# Altium schematic sheet sensors.SchDoc: SENSORS unit
size A2; DocumentNumber: UCNC.02.00.001
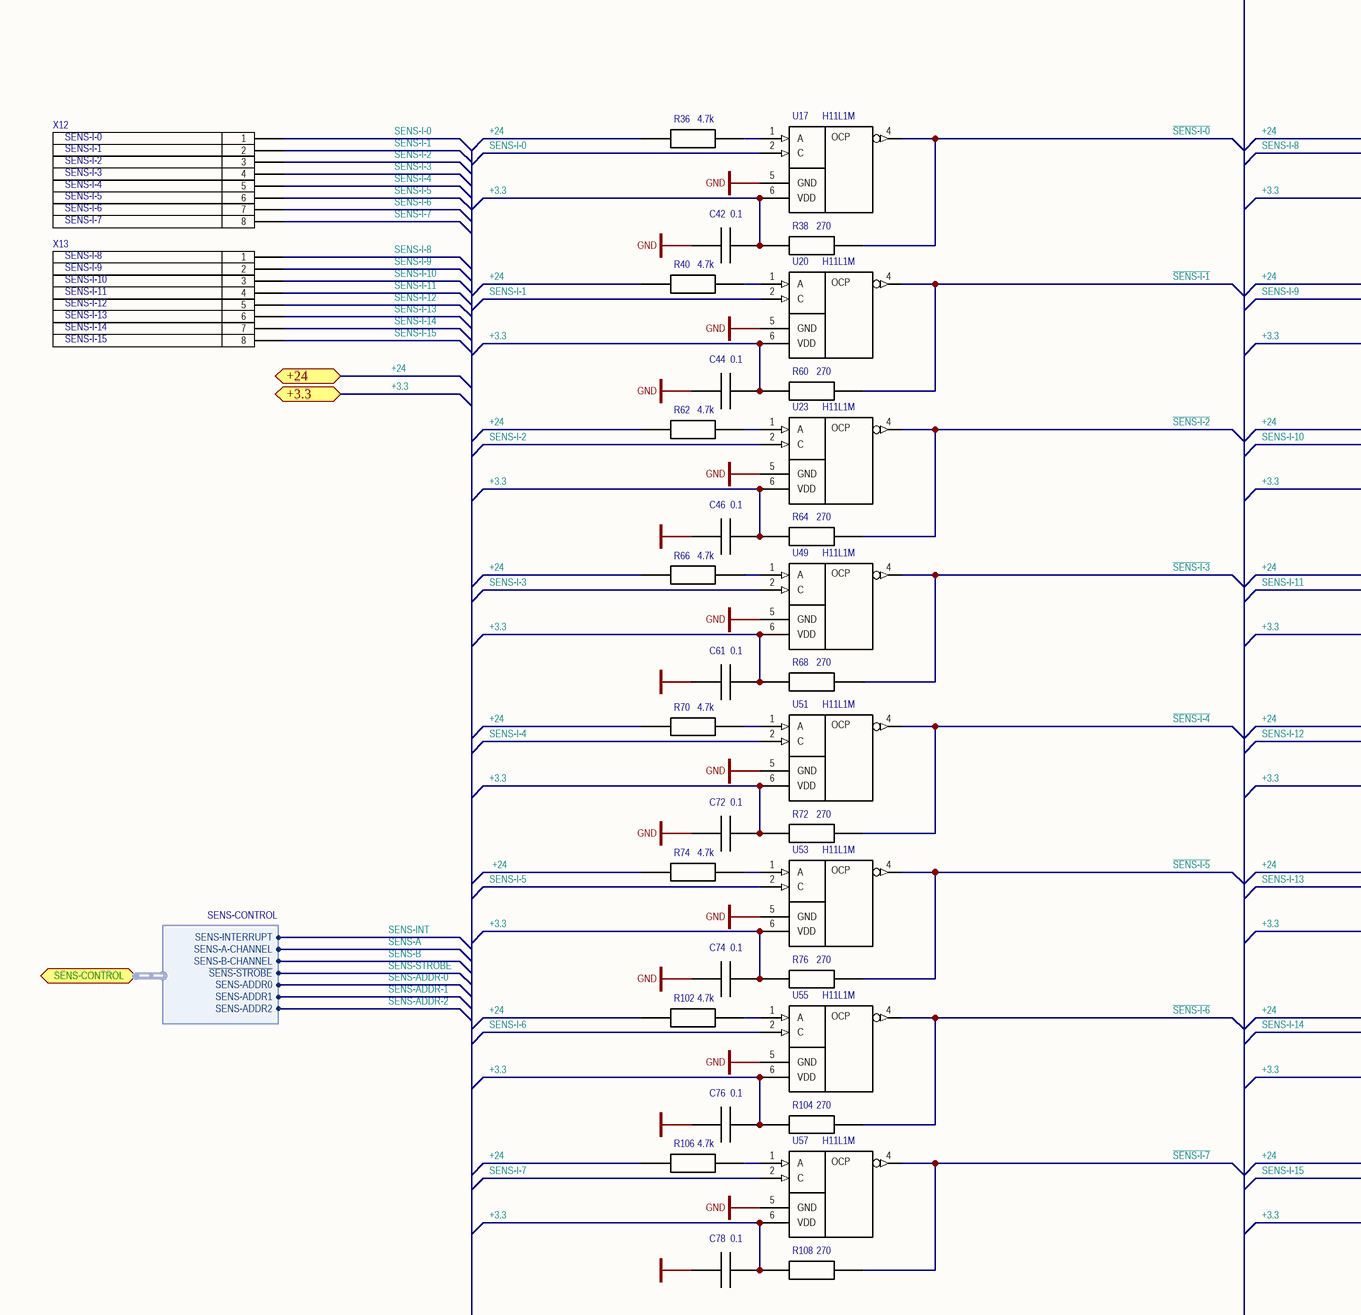
[diagram p0: sensors.SchDoc, top left]
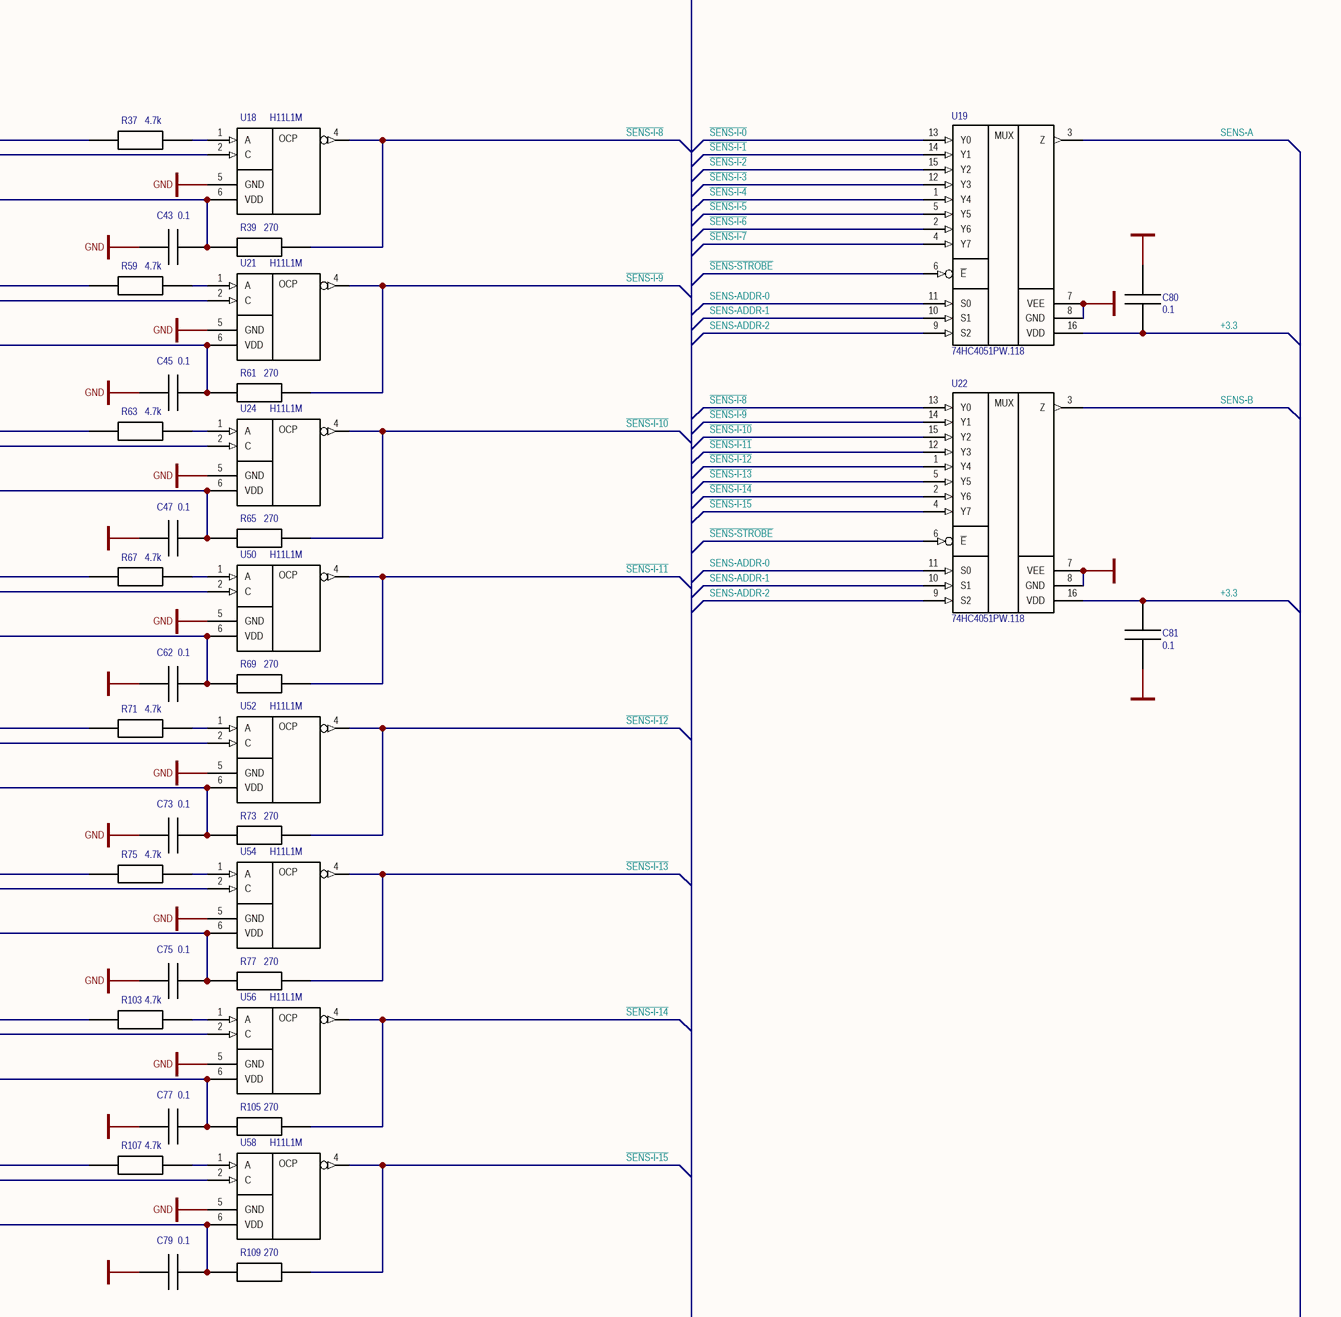
[diagram p1: sensors.SchDoc, top right]
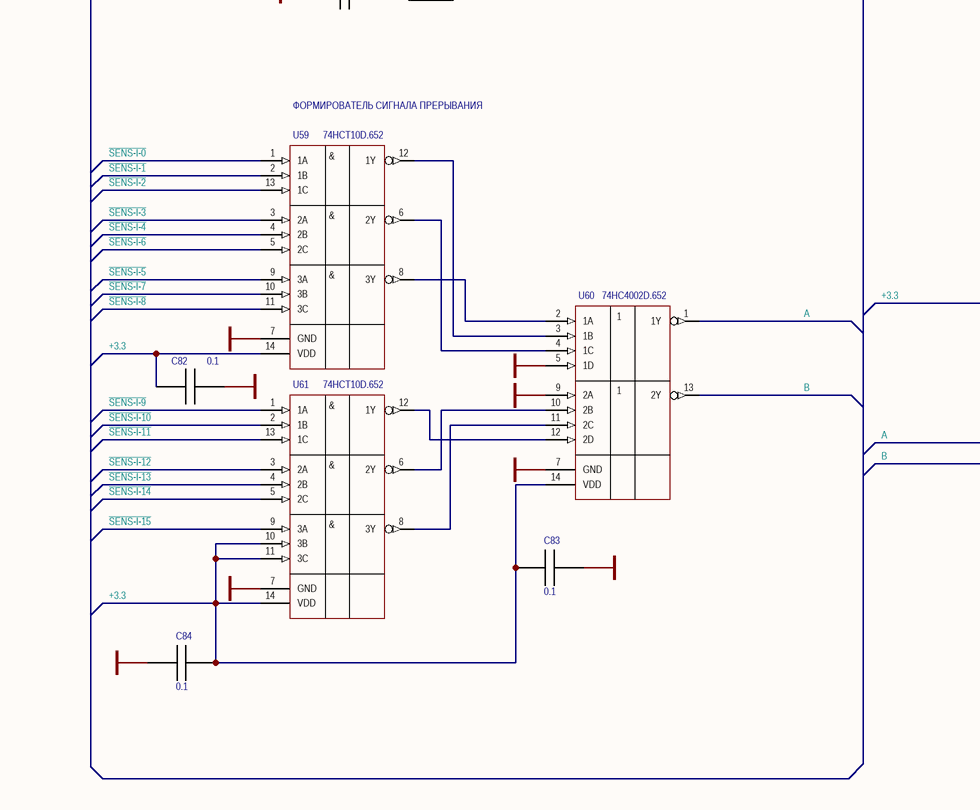
[diagram p2: sensors.SchDoc, bottom left]
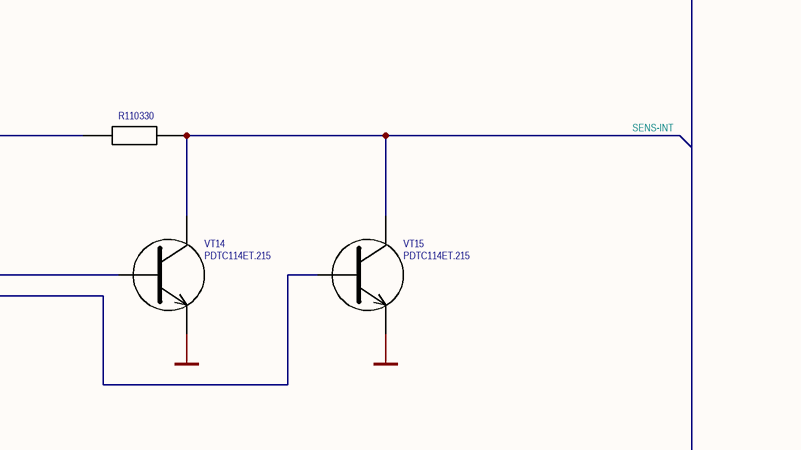
[diagram p3: sensors.SchDoc, bottom right]

## Parts
C42  0.1  [CAPC2012X04N]
C43  0.1  [CAPC2012X04N]
C44  0.1  [CAPC2012X04N]
C45  0.1  [CAPC2012X04N]
C46  0.1  [CAPC2012X04N]
C47  0.1  [CAPC2012X04N]
C61  0.1  [CAPC2012X04N]
C62  0.1  [CAPC2012X04N]
C72  0.1  [CAPC2012X04N]
C73  0.1  [CAPC2012X04N]
C74  0.1  [CAPC2012X04N]
C75  0.1  [CAPC2012X04N]
C76  0.1  [CAPC2012X04N]
C77  0.1  [CAPC2012X04N]
C78  0.1  [CAPC2012X04N]
C79  0.1  [CAPC2012X04N]
C80  0.1  [CAPC2012X04N]
C81  0.1  [CAPC2012X04N]
C82  0.1  [CAPC2012X04N]
C83  0.1  [CAPC2012X04N]
C84  0.1  [CAPC2012X04N]
R36  4.7k  [RESC2012X04N]
R37  4.7k  [RESC2012X04N]
R38  270  [RESC2012X04N]
R39  270  [RESC2012X04N]
R40  4.7k  [RESC2012X04N]
R59  4.7k  [RESC2012X04N]
R60  270  [RESC2012X04N]
R61  270  [RESC2012X04N]
R62  4.7k  [RESC2012X04N]
R63  4.7k  [RESC2012X04N]
R64  270  [RESC2012X04N]
R65  270  [RESC2012X04N]
R66  4.7k  [RESC2012X04N]
R67  4.7k  [RESC2012X04N]
R68  270  [RESC2012X04N]
R69  270  [RESC2012X04N]
R70  4.7k  [RESC2012X04N]
R71  4.7k  [RESC2012X04N]
R72  270  [RESC2012X04N]
R73  270  [RESC2012X04N]
R74  4.7k  [RESC2012X04N]
R75  4.7k  [RESC2012X04N]
R76  270  [RESC2012X04N]
R77  270  [RESC2012X04N]
R102  4.7k  [RESC2012X04N]
R103  4.7k  [RESC2012X04N]
R104  270  [RESC2012X04N]
R105  270  [RESC2012X04N]
R106  4.7k  [RESC2012X04N]
R107  4.7k  [RESC2012X04N]
R108  270  [RESC2012X04N]
R109  270  [RESC2012X04N]
R110  330  [RESC3216X05N]
U17  H11L1M  [DIP6]
U18  H11L1M  [DIP6]
U19  74HC4051PW.118  [TSOP65P640X120-16N]
U20  H11L1M  [DIP6]
U21  H11L1M  [DIP6]
U22  74HC4051PW.118  [TSOP65P640X120-16N]
U23  H11L1M  [DIP6]
U24  H11L1M  [DIP6]
U49  H11L1M  [DIP6]
U50  H11L1M  [DIP6]
U51  H11L1M  [DIP6]
U52  H11L1M  [DIP6]
U53  H11L1M  [DIP6]
U54  H11L1M  [DIP6]
U55  H11L1M  [DIP6]
U56  H11L1M  [DIP6]
U57  H11L1M  [DIP6]
U58  H11L1M  [DIP6]
U59  74HCT10D.652  [SOIC127P600X175-14N]
U60  74HC4002D.652  [SOIC127P600X175-14N]
U61  74HCT10D.652  [SOIC127P600X175-14N]
VT14  PDTC114ET.215  [SOT95P238X102-3N]
VT15  PDTC114ET.215  [SOT95P238X102-3N]
X12  MINI-FIT-8-WAY-M  [MINI-FIT-8-WAY-SM]  (value not drawn)
X13  MINI-FIT-8-WAY-M  [MINI-FIT-8-WAY-SM]  (value not drawn)

## Ports
+3.3, +24, SENS-CONTROL (harness SENS-CONTROL)

## Harnesses
SENS-CONTROL: SENS-INTERRUPT, SENS-A-CHANNEL, SENS-B-CHANNEL, ~{SENS-STROBE}, SENS-ADDR0, SENS-ADDR1, SENS-ADDR2

## Nets
GND: C42.1 C43.1 C44.1 C45.1 C46.1 C47.1 C61.1 C62.1 C72.1 C73.1 C74.1 C75.1 C76.1 C77.1 C78.1 C79.1 C80.2 C81.1 C82.2 C83.2 C84.1 U17.5(GND) U18.5(GND) U19.7(VEE) U19.8(GND) U20.5(GND) U21.5(GND) U22.7(VEE) U22.8(GND) U23.5(GND) U24.5(GND) U49.5(GND) U50.5(GND) U51.5(GND) U52.5(GND) U53.5(GND) U54.5(GND) U55.5(GND) U56.5(GND) U57.5(GND) U58.5(GND) U59.7(GND) U60.5(1D) U60.7(GND) U60.9(2A) U61.7(GND) VT14.2(E) VT15.2(E)
+3.3: C42.2 C43.2 C44.2 C45.2 C46.2 C47.2 C61.2 C62.2 C72.2 C73.2 C74.2 C75.2 C76.2 C77.2 C78.2 C79.2 C80.1 C81.2 C82.1 C83.1 C84.2 R38.1 R39.1 R60.1 R61.1 R64.1 R65.1 R68.1 R69.1 R72.1 R73.1 R76.1 R77.1 R104.1 R105.1 R108.1 R109.1 R110.1 U17.6(VDD) U18.6(VDD) U19.16(VDD) U20.6(VDD) U21.6(VDD) U22.16(VDD) U23.6(VDD) U24.6(VDD) U49.6(VDD) U50.6(VDD) U51.6(VDD) U52.6(VDD) U53.6(VDD) U54.6(VDD) U55.6(VDD) U56.6(VDD) U57.6(VDD) U58.6(VDD) U59.14(VDD) U60.14(VDD) U61.10(3B) U61.11(3C) U61.14(VDD) ; port +3.3
+24: R36.1 R37.1 R40.1 R59.1 R62.1 R63.1 R66.1 R67.1 R70.1 R71.1 R74.1 R75.1 R102.1 R103.1 R106.1 R107.1 ; port +24
A: U60.1(1Y) VT14.1(B)
B: U60.13(2Y) VT15.1(B)
~{SENS-I-0}: R38.2 U17.4(OUT) U19.13(Y0) U59.1(1A)
~{SENS-I-1}: R60.2 U19.14(Y1) U20.4(OUT) U59.2(1B)
~{SENS-I-10}: R65.2 U22.15(Y2) U24.4(OUT) U61.2(1B)
~{SENS-I-11}: R69.2 U22.12(Y3) U50.4(OUT) U61.13(1C)
~{SENS-I-12}: R73.2 U22.1(Y4) U52.4(OUT) U61.3(2A)
~{SENS-I-13}: R77.2 U22.5(Y5) U54.4(OUT) U61.4(2B)
~{SENS-I-14}: R105.2 U22.2(Y6) U56.4(OUT) U61.5(2C)
~{SENS-I-15}: R109.2 U22.4(Y7) U58.4(OUT) U61.9(3A)
~{SENS-I-2}: R64.2 U19.15(Y2) U23.4(OUT) U59.13(1C)
~{SENS-I-3}: R68.2 U19.12(Y3) U49.4(OUT) U59.3(2A)
~{SENS-I-4}: R72.2 U19.1(Y4) U51.4(OUT) U59.4(2B)
~{SENS-I-5}: R76.2 U19.5(Y5) U53.4(OUT) U59.9(3A)
~{SENS-I-6}: R104.2 U19.2(Y6) U55.4(OUT) U59.5(2C)
~{SENS-I-7}: R108.2 U19.4(Y7) U57.4(OUT) U59.10(3B)
~{SENS-I-8}: R39.2 U18.4(OUT) U22.13(Y0) U59.11(3C)
~{SENS-I-9}: R61.2 U21.4(OUT) U22.14(Y1) U61.1(1A)
~{SENS-STROBE}: U19.6(~{E}) U22.6(~{E}) ; port SENS-CONTROL.~{SENS-STROBE}
SENS-A: U19.3(Z) ; port SENS-CONTROL.SENS-A-CHANNEL
SENS-ADDR-0: U19.11(S0) U22.11(S0) ; port SENS-CONTROL.SENS-ADDR0
SENS-ADDR-1: U19.10(S1) U22.10(S1) ; port SENS-CONTROL.SENS-ADDR1
SENS-ADDR-2: U19.9(S2) U22.9(S2) ; port SENS-CONTROL.SENS-ADDR2
SENS-B: U22.3(Z) ; port SENS-CONTROL.SENS-B-CHANNEL
SENS-I-0: U17.2(C) X12.1
SENS-I-1: U20.2(C) X12.2
SENS-I-2: U23.2(C) X12.3
SENS-I-3: U49.2(C) X12.4
SENS-I-4: U51.2(C) X12.5
SENS-I-5: U53.2(C) X12.6
SENS-I-6: U55.2(C) X12.7
SENS-I-7: U57.2(C) X12.8
SENS-I-8: U18.2(C) X13.1
SENS-I-9: U21.2(C) X13.2
SENS-I-10: U24.2(C) X13.3
SENS-I-11: U50.2(C) X13.4
SENS-I-12: U52.2(C) X13.5
SENS-I-13: U54.2(C) X13.6
SENS-I-14: U56.2(C) X13.7
SENS-I-15: U58.2(C) X13.8
SENS-INT: R110.2 VT14.3(C) VT15.3(C) ; port SENS-CONTROL.SENS-INTERRUPT
NetR36_2: R36.2 U17.1(A)
NetR37_2: R37.2 U18.1(A)
NetR40_2: R40.2 U20.1(A)
NetR59_2: R59.2 U21.1(A)
NetR62_2: R62.2 U23.1(A)
NetR63_2: R63.2 U24.1(A)
NetR66_2: R66.2 U49.1(A)
NetR67_2: R67.2 U50.1(A)
NetR70_2: R70.2 U51.1(A)
NetR71_2: R71.2 U52.1(A)
NetR74_2: R74.2 U53.1(A)
NetR75_2: R75.2 U54.1(A)
NetR102_2: R102.2 U55.1(A)
NetR103_2: R103.2 U56.1(A)
NetR106_2: R106.2 U57.1(A)
NetR107_2: R107.2 U58.1(A)
NetU59_6: U59.6(2Y) U60.4(1C)
NetU59_8: U59.8(3Y) U60.2(1A)
NetU59_12: U59.12(1Y) U60.3(1B)
NetU60_10: U60.10(2B) U61.6(2Y)
NetU60_11: U60.11(2C) U61.8(3Y)
NetU60_12: U60.12(2D) U61.12(1Y)

## Notes on the sheet
- SENS-I-0
- SENS-I-1
- SENS-I-2
- SENS-I-3
- SENS-I-4
- SENS-I-5
- SENS-I-6
- SENS-I-7
- SENS-I-8
- SENS-I-9
- SENS-I-10
- SENS-I-11
- SENS-I-12
- SENS-I-13
- SENS-I-14
- SENS-I-15
- (near U59) ФОРМИРОВАТЕЛЬ СИГНАЛА ПРЕРЫВАНИЯ
- (in symbol 74HC4051PW.118) MUX
- (in symbol 74HCT10D.652) &
- (in symbol H11L1M) OCP

## Library data of the parts
C42-C47 C61 C62 C72-C84 = C: SMD конденсатор; Ref: http://www.kosmodrom.com.ua/prodlist.php?name=cap1206
R36-R40 R59-R77 R102-R110 = R: SMD резистор; Ref: http://www.kosmodrom.com.ua/prodlist.php?name=res1206
U17 U18 U20 U21 U23 U24 U49-U58 = H11L1M: Fairchild H11L1M Schmitt Trigger Output Optocoupler; Ref: http://www.kosmodrom.com.ua/el.php?name=H11L1M
VT14 VT15 = PDTC114ET.215: NPN transistor with bias circuit